# EAGLE design BUZZI-40 (EAGLE 4.15)
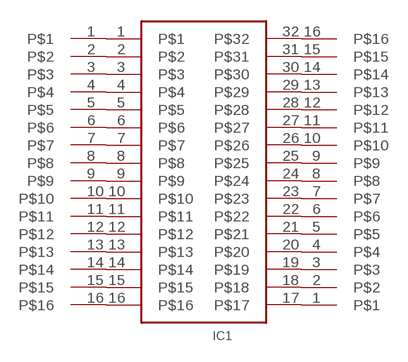
[diagram p0: schematic, sheet 1]

## Parts
CON1  MA16  [MA16-1]
CON2  MA16  [MA16-1]
IC1  QFN-32  GENERIC32PIN  [S-PQFP-N32(RHB)]

## Nets
N$1: CON1.1 IC1.1
N$2: CON1.2 IC1.2
N$3: CON1.3 IC1.3
N$4: CON1.4 IC1.4
N$5: CON1.5 IC1.5
N$6: CON1.6 IC1.6
N$7: CON1.7 IC1.7
N$8: CON1.8 IC1.8
N$9: CON1.9 IC1.9
N$10: CON1.10 IC1.10
N$11: CON1.11 IC1.11
N$12: CON1.12 IC1.12
N$13: CON1.13 IC1.13
N$14: CON1.14 IC1.14
N$15: CON1.15 IC1.15
N$16: CON1.16 IC1.16
N$17: CON2.1 IC1.17
N$18: CON2.2 IC1.18
N$19: CON2.3 IC1.19
N$20: CON2.4 IC1.20
N$21: CON2.5 IC1.21
N$22: CON2.6 IC1.22
N$23: CON2.7 IC1.23
N$24: CON2.8 IC1.24
N$25: CON2.9 IC1.25
N$26: CON2.10 IC1.26
N$27: CON2.11 IC1.27
N$28: CON2.12 IC1.28
N$29: CON2.13 IC1.29
N$30: CON2.14 IC1.30
N$31: CON2.15 IC1.31
N$32: CON2.16 IC1.32

## Library data of the parts
CON1 CON2 = turbod3:MA16
IC1 = turbod3:GENERIC32PIN

## Board
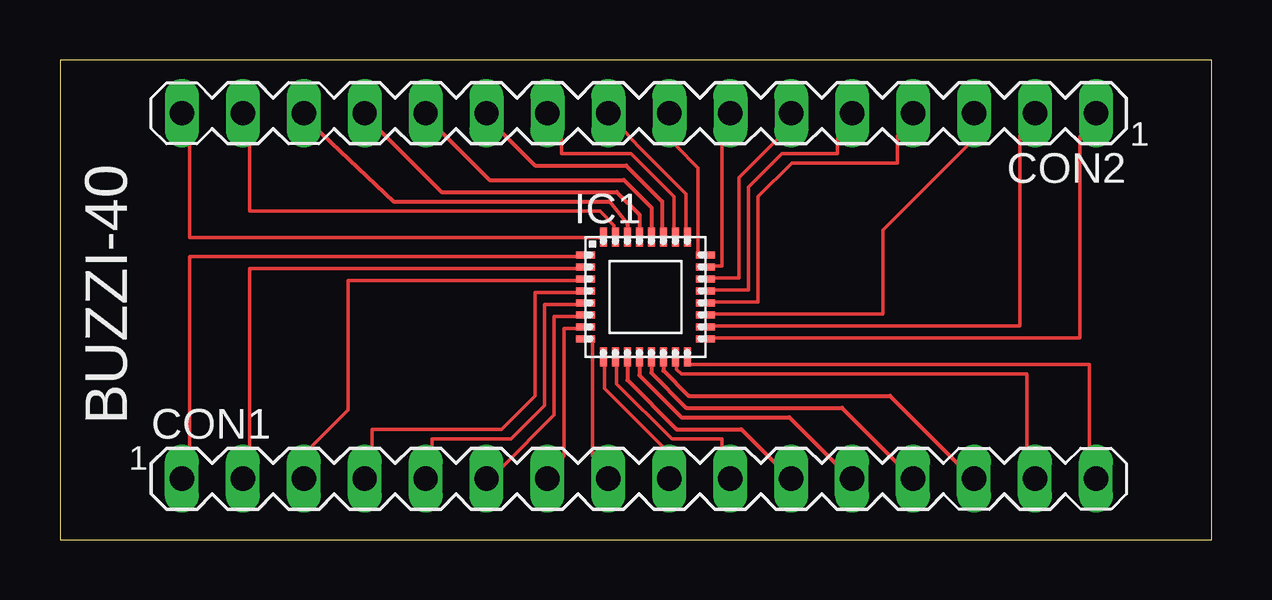
[diagram p1: board, top side]

Size 48 x 20 mm. Coordinates in mm from the lower left corner, seen from the top.
Outline: 0,0 48,0 48,20 0,20 0,0
Copper layers (1*16): Top 0.035mm / dielectric 1.5mm / Bottom 0.035mm
Design rules "PCB-POOL": minimum track width 6mil, minimum drill 12mil, track to track 6mil, track to pad 6mil, pad to pad 6mil, via to via 6mil, smd to smd 6mil, copper to edge 20mil, drill to drill 8mil, minimum pad ring 8mil, minimum via ring 6mil, stop-mask expansion 3mil, vias tented up to drill 0mil, thermal gap 8mil

### Footprints (pad centres in the part's own frame; a part is rotated, then mirrored left to right if it is on the bottom)
MA16-1 = drill 1.016 long: 1 -17.78,0; 2 -15.24,0; 3 -12.7,0; 4 -10.16,0; 5 -7.62,0; 6 -5.08,0; 7 -2.54,0; 8 0,0; 9 2.54,0; 10 5.08,0; 11 7.62,0; 12 10.16,0; 13 12.7,0; 14 15.24,0; 15 17.78,0; 16 20.32,0
S-PQFP-N32(RHB) = smd 0.8 x 0.3: 1 -2.5,1.75; 2 -2.5,1.25; 3 -2.5,0.75; 4 -2.5,0.25; 5 -2.5,-0.25; 6 -2.5,-0.75; 7 -2.5,-1.25; 8 -2.5,-1.75; 17 2.5,-1.75; 18 2.5,-1.25; 19 2.5,-0.75; 20 2.5,-0.25; 21 2.5,0.25; 22 2.5,0.75; 23 2.5,1.25; 24 2.5,1.75 | smd 0.3 x 0.8: 9 -1.75,-2.5; 10 -1.25,-2.5; 11 -0.75,-2.5; 12 -0.25,-2.5; 13 0.25,-2.5; 14 0.75,-2.5; 15 1.25,-2.5; 16 1.75,-2.5; 25 1.75,2.5; 26 1.25,2.5; 27 0.75,2.5; 28 0.25,2.5; 29 -0.25,2.5; 30 -0.75,2.5; 31 -1.25,2.5; 32 -1.75,2.5

### Placement (x,y rotation side)
CON1  22.86,2.54 0 top
CON2  25.4,17.78 180 top
IC1  24.4,10.12 0 top

### Tracks (layer width: path | path; a pad name or v marks a point on that pad's centre or on a via)
N$1
  Top 0.152: IC1.1 21.6,11.8 5.4,11.8 5.4,3.9 CON1.1
N$2
  Top 0.152: IC1.2 21.6,11.3 7.9,11.3 7.9,3.9 CON1.2
N$3
  Top 0.152: IC1.3 21.6,10.8 12,10.8 12,5.4 10.5,3.9 CON1.3
N$4
  Top 0.152: IC1.4 21.6,10.3 19.8,10.3 19.8,6 18.4,4.6 13,4.6 13,3.9 CON1.4
N$5
  Top 0.152: IC1.5 21.6,9.8 20.2,9.8 20.2,5.6 18.8,4.2 15.5,4.2 15.5,3.9 CON1.5
N$6
  Top 0.152: IC1.6 21.6,9.3 20.6,9.3 20.6,5.2 18.4,3 CON1.6
N$7
  Top 0.152: IC1.7 21.6,8.8 21,8.8 21,3.5 CON1.7
N$8
  Top 0.152: IC1.8 22.2,8.3 22.2,3.5 CON1.8
N$9
  Top 0.152: IC1.9 22.7,7.3 22.7,6.3 25.1,3.9 CON1.9
N$10
  Top 0.152: IC1.10 23.2,7.3 23.2,6.5 25.5,4.2 27.6,4.2 27.6,3.9 CON1.10
N$11
  Top 0.16: IC1.11 23.65,6.65 25.7,4.6 28.4,4.6 30.48,2.52 | 30.5,2.5 30.48,2.52 | 30.48,2.52 CON1.11
N$12
  Top 0.16: IC1.12 24.15,6.85 25.9,5.1 30.4,5.1 33.02,2.48 | 33.1,2.4 33.02,2.48 | 33.02,2.48 CON1.12
N$13
  Top 0.16: IC1.13 24.65,6.95 26.1,5.5 32.6,5.5 CON1.13 35.6,2.5
N$14
  Top 0.16: IC1.14 25.15,7.05 26.2,6 34.6,6 38.06,2.54 CON1.14
N$15
  Top 0.152: IC1.15 25.7,7.3 25.7,7.1 25.9,6.9 40.3,6.9 40.3,3.9 CON1.15
N$16
  Top 0.152: IC1.16 26.2,7.3 42.9,7.3 42.9,3.9 CON1.16
N$17
  Top 0.152: IC1.17 27.2,8.4 42.5,8.4 42.5,16.8 CON2.1
N$18
  Top 0.152: IC1.18 27.2,8.9 40,8.9 40,16.8 CON2.2
N$19
  Top 0.152: IC1.19 27.2,9.4 34.3,9.4 34.3,12.9 37.8,16.4 CON2.3
N$20
  Top 0.152: IC1.20 27.2,9.9 29.1,9.9 29.1,14.3 30.5,15.7 34.9,15.7 34.9,16.8 CON2.4
N$21
  Top 0.152: IC1.21 27.2,10.4 28.7,10.4 28.7,14.7 30.1,16.1 32.4,16.1 32.4,16.7 CON2.5
N$22
  Top 0.152: IC1.22 27.2,10.9 28.3,10.9 28.3,15.1 29.9,16.7 CON2.6
N$23
  Top 0.152: IC1.23 27.2,11.4 27.6,11.4 27.6,16.5 CON2.7
N$24
  Top 0.152: IC1.24 26.6,12 26.6,15.5 25.7,16.4 CON2.8
N$25
  Top 0.152: IC1.25 26.1,13 26.1,14.4 24.1,16.4 CON2.9
N$26
  Top 0.152: IC1.26 25.6,13 25.6,14.3 23.8,16.1 20.9,16.1 20.9,16.7 CON2.10
N$27
  Top 0.16: IC1.27 25.1,12.62 25.1,14.1 23.6,15.6 19.8,15.6 17.7,17.7 CON2.11
N$28
  Top 0.16: IC1.28 24.65,13.85 23.5,15 17.9,15 15.2,17.7 15.24,17.74 CON2.12
N$29
  Top 0.16: IC1.29 24.15,13.55 23.2,14.5 15.9,14.5 12.7,17.7 CON2.13
N$30
  Top 0.16: IC1.30 23.65,13.15 22.9,14.1 13.9,14.1 10.16,17.64 CON2.14
N$31
  Top 0.152: IC1.31 23.1,13 23.1,13.1 22.5,13.7 7.9,13.7 7.9,16.4 CON2.15
N$32
  Top 0.152: CON2.16 5.4,16.4 5.4,12.6 22.6,12.6 IC1.32

### Text on the board
tNames: BUZZI-40